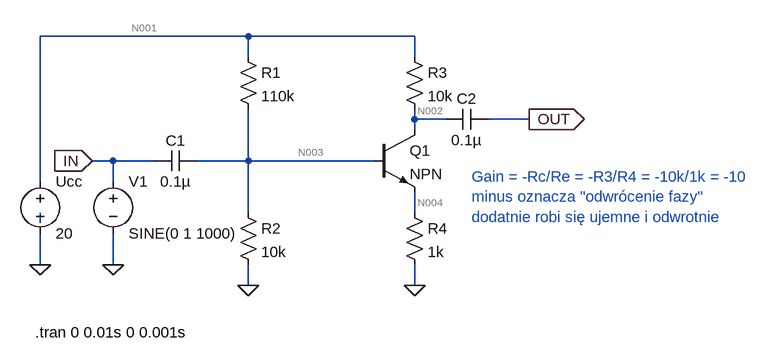
[diagram p0: schematic schemat.asc]
schemat.asc, the LTspice schematic file:
Version 4
SHEET 1 880 680
WIRE -336 -176 -656 -176
WIRE -80 -176 -336 -176
WIRE -336 -144 -336 -176
WIRE -80 -144 -80 -176
WIRE -80 -48 -80 -64
WIRE -32 -48 -80 -48
WIRE 96 -48 32 -48
WIRE -80 -32 -80 -48
WIRE -544 16 -576 16
WIRE -480 16 -544 16
WIRE -336 16 -336 -64
WIRE -336 16 -416 16
WIRE -144 16 -336 16
WIRE -656 48 -656 -176
WIRE -544 48 -544 16
WIRE -336 96 -336 16
WIRE -80 96 -80 64
WIRE -656 112 -656 96
WIRE -656 176 -656 128
WIRE -544 176 -544 128
WIRE -336 208 -336 176
WIRE -80 208 -80 176
FLAG -336 208 0
FLAG -80 208 0
FLAG -544 176 0
FLAG -656 176 0
FLAG 96 -48 OUT
IOPIN 96 -48 Out
FLAG -576 16 IN
IOPIN -576 16 In
SYMBOL voltage -656 32 R0
WINDOW 123 0 0 Left 0
WINDOW 39 0 0 Left 0
SYMATTR InstName Ucc
SYMATTR Value 20
SYMBOL cap -416 0 R90
WINDOW 0 0 32 VBottom 2
WINDOW 3 32 32 VTop 2
SYMATTR InstName C1
SYMATTR Value 0.1µ
SYMBOL res -352 -160 R0
SYMATTR InstName R1
SYMATTR Value 110k
SYMBOL res -352 80 R0
SYMATTR InstName R2
SYMATTR Value 10k
SYMBOL res -96 -160 R0
SYMATTR InstName R3
SYMATTR Value 10k
SYMBOL res -96 80 R0
SYMATTR InstName R4
SYMATTR Value 1k
SYMBOL npn -144 -32 R0
SYMATTR InstName Q1
SYMBOL voltage -544 32 R0
WINDOW 123 0 0 Left 0
WINDOW 39 0 0 Left 0
SYMATTR InstName V1
SYMATTR Value SINE(0 1 1000)
SYMBOL cap 32 -64 R90
WINDOW 0 0 32 VBottom 2
WINDOW 3 32 32 VTop 2
SYMATTR InstName C2
SYMATTR Value 0.1µ
TEXT -664 280 Left 2 !.tran 0 0.01s 0 0.001s
TEXT 8 40 Left 2 ;Gain = -Rc/Re = -R3/R4 = -10k/1k = -10\nminus oznacza "odwrócenie fazy"\ndodatnie robi się ujemne i odwrotnie

The netlist it stands for:
* schemat.asc
V§Ucc N001 0 20
C1 N003 IN 0.1µ
R1 N001 N003 110k
R2 N003 0 10k
R3 N001 N002 10k
R4 N004 0 1k
Q1 N002 N003 N004 0 NPN
V1 IN 0 SINE(0 1 1000)
C2 OUT N002 0.1µ
.model NPN NPN
.model PNP PNP
.lib standard.bjt
.tran 0 0.01s 0 0.001s
* Gain = -Rc/Re = -R3/R4 = -10k/1k = -10
* minus oznacza "odwrócenie fazy"
* dodatnie robi się ujemne i odwrotnie
.backanno
.end

* Results of the author's LTspice run, read from the files saved beside the schematic
* Operating Point, zero values left out:
*   V(n001) = 20 V
*   V(n003) = 1.592 V
*   V(n002) = 11.85 V
*   V(n004) = 823 mV
*   V(out) = 1.185 µV
*   Ic(Q1) = 814.9 µA
*   Ib(Q1) = 8.149 µA
*   Ie(Q1) = -823.1 µA
*   I(R1) = 167.3 µA
*   I(R2) = 159.2 µA
*   I(R3) = 814.9 µA
*   I(R4) = 823 µA
*   I(Ucc) = -982.2 µA
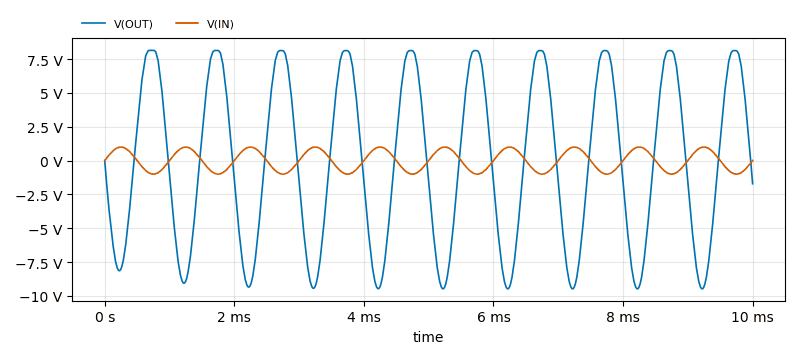
[diagram p1: Transient Analysis of schemat.asc, plotted from the saved traces]
* Transient Analysis, 1 run:
*   V(OUT): min -9.48 V, max 8.148 V, average -118.7 mV, rms 6.356 V, last -1.716 V
*   V(IN): min -999.5 mV, max 999.5 mV, average 31.38 µV, rms 718.4 mV, last 0 V